# EAGLE design EnvironmentMonitorV6.0 (EAGLE 7.4.0)
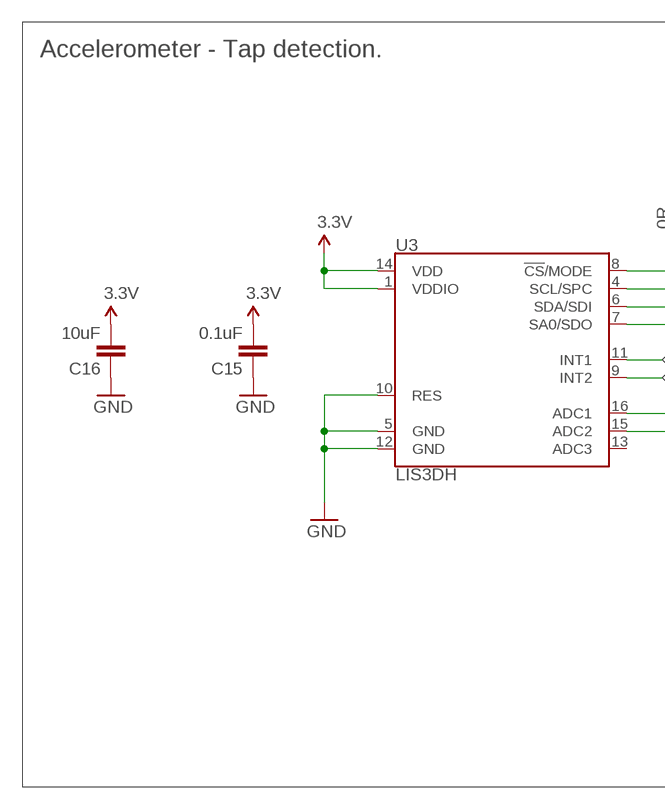
[diagram p0: schematic, sheet 1, part 1 of 2]
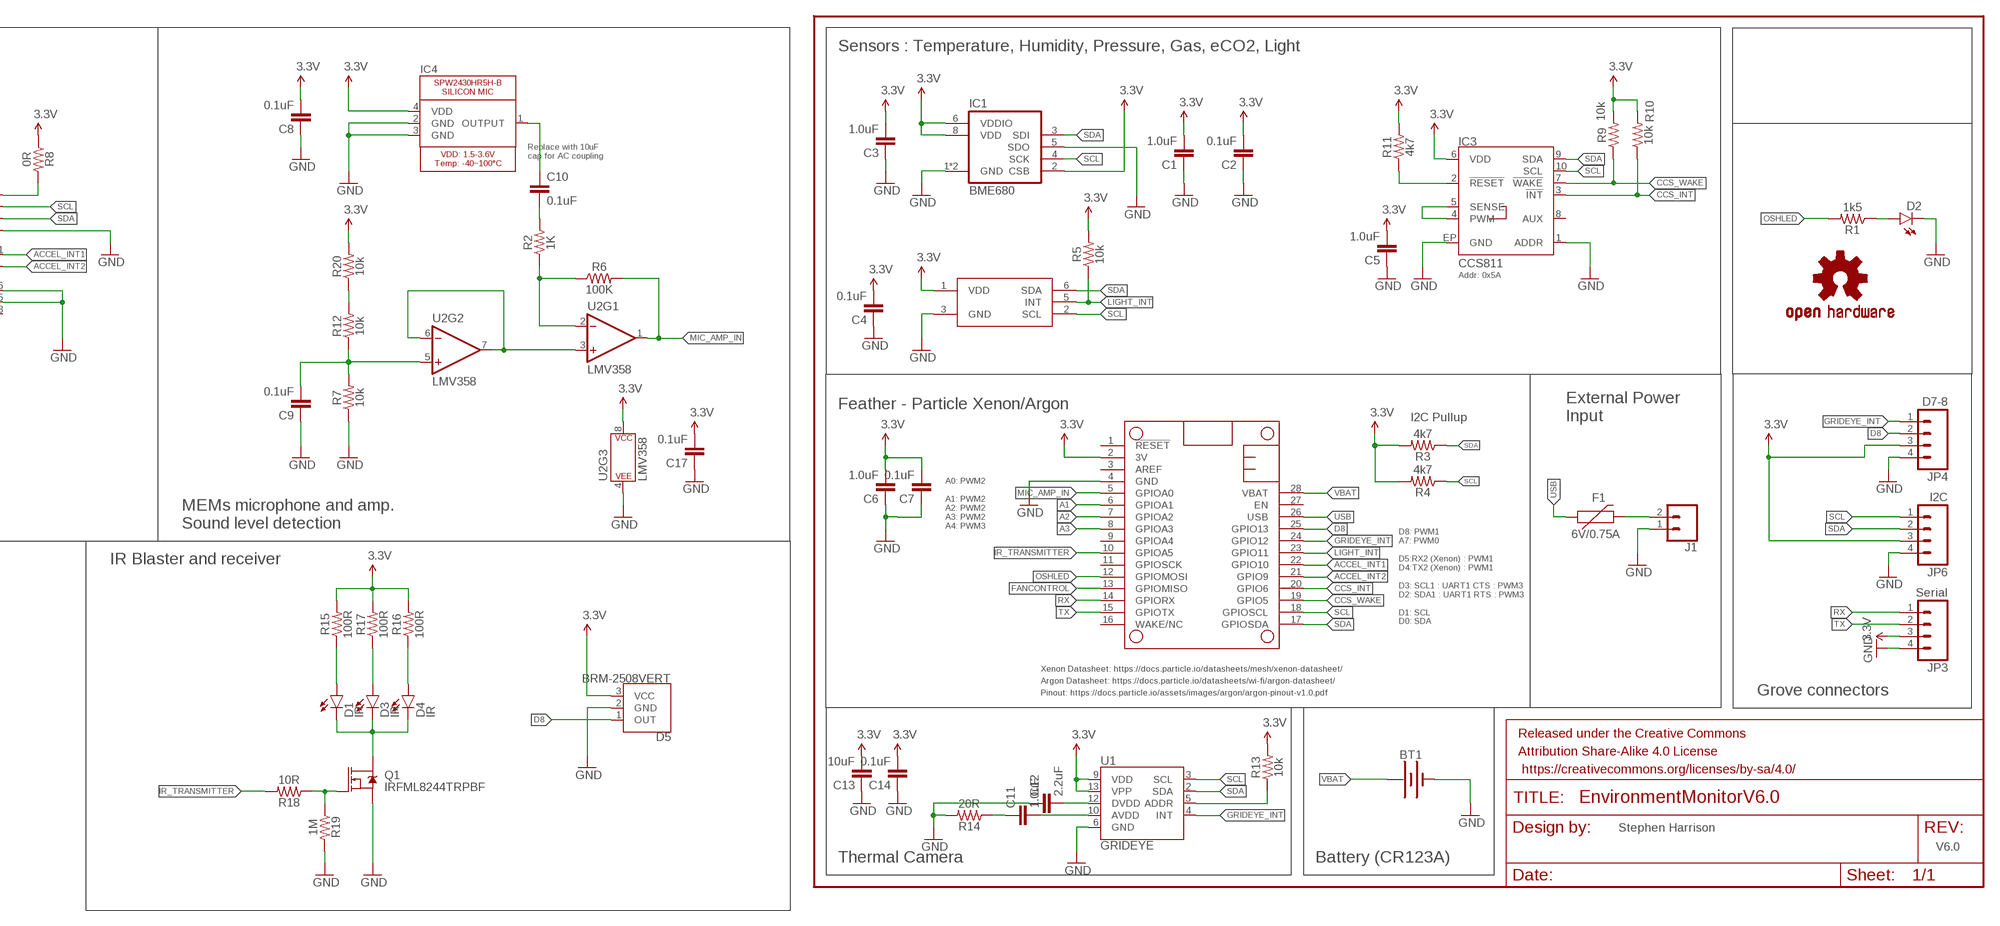
[diagram p1: schematic, sheet 1, part 2 of 2]

## Parts
BT1  BATTERY-16340  [BATTERY_16340-HOLDER]
C1  1.0uF  1.0UF-25V-+80/-20(0805)"  [0805-CAP]
C2  0.1uF  1.0UF-25V-+80/-20(0805)"  [0805-CAP]
C3  1.0uF  1.0UF-25V-+80/-20(0805)"  [0805-CAP]
C4  0.1uF  1.0UF-25V-+80/-20(0805)"  [0805-CAP]
C5  1.0uF  1.0UF-25V-+80/-20(0805)"  [0805-CAP]
C6  1.0uF  1.0UF-25V-+80/-20(0805)"  [0805-CAP]
C7  0.1uF  1.0UF-25V-+80/-20(0805)"  [0805-CAP]
C8  0.1uF  1.0UF-25V-+80/-20(0805)"  [0805-CAP]
C9  0.1uF  1.0UF-25V-+80/-20(0805)"  [0805-CAP]
C10  0.1uF  1.0UF-25V-+80/-20(0805)"  [0805-CAP]
C11  1.0uF  1.0UF-25V-+80/-20(0805)"  [0805-CAP]
C12  2.2uF  1.0UF-25V-+80/-20(0805)"  [0805-CAP]
C13  10uF  1.0UF-25V-+80/-20(0805)"  [0805-CAP]
C14  0.1uF  1.0UF-25V-+80/-20(0805)"  [0805-CAP]
C15  0.1uF  1.0UF-25V-+80/-20(0805)"  [0805-CAP]
C16  10uF  1.0UF-25V-+80/-20(0805)"  [0805-CAP]
C17  0.1uF  1.0UF-25V-+80/-20(0805)"  [0805-CAP]
D1  IR  LED1206  [LED-1206]
D2  LED1206-BOTTOM  [LED-1206-BOTTOM]
D3  IR  LED1206  [LED-1206]
D4  IR  LED1206  [LED-1206]
D5  BRM-2508VERT  [BRM-2508_VERT]
F1  6V/0.75A  PPTC_THREE-QUARTER-AMP  [1206]
FRAME1  FRAME-LETTER  [CREATIVE_COMMONS]
IC1  BME680  [BME680]
IC2  TCS3472  [FN-6]
IC3  CCS811  [LGA10]
IC4  SPW2430HR5H-B  [SPW2430HR5H-B]
IC5  FEATHERWING_NODIM  [FEATHERWING_DIM]
J1  CONN_02-JST-2MM-SMT  [JST-2-SMD]
JP3  Serial  M04JST-PTH-VERT  [JST-4-PTH-VERT]
JP4  D7-8  M04JST-PTH-VERT  [JST-4-PTH-VERT]
JP6  I2C  M04JST-PTH-VERT  [JST-4-PTH-VERT]
LOGO1  OSHW-LOGOM  [OSHW-LOGO-M]
Q1  IRFML8244TRPBF  MOSFET-NCH-BSS138  [SOT23-3]
R1  1k5  RESISTOR0805  [0805]
R2  1K  RESISTOR0805  [0805]
R3  4k7  RESISTOR0805  [0805]
R4  4k7  RESISTOR0805  [0805]
R5  10k  RESISTOR0805  [0805]
R6  100K  RESISTOR0805  [0805]
R7  10k  RESISTOR0805  [0805]
R8  0R  RESISTOR0805  [0805]
R9  10k  RESISTOR0805  [0805]
R10  10k  RESISTOR0805  [0805]
R11  4k7  RESISTOR0805  [0805]
R12  10k  RESISTOR0805  [0805]
R13  10k  RESISTOR0805  [0805]
R14  20R  RESISTOR0805  [0805]
R15  100R  RESISTOR0805  [0805]
R16  100R  RESISTOR0805  [0805]
R17  100R  RESISTOR0805  [0805]
R18  10R  RESISTOR0805  [0805]
R19  1M  RESISTOR0805  [0805]
R20  10k  RESISTOR0805  [0805]
U1  GRIDEYE  [GRIDEYE-AMG88]
U2  LMV358  LMV358SOIC  [SO08]
U3  LIS3DH  [LGA-16-3X3]

## Nets
3.3V: C1.2 C2.2 C3.2 C4.2 C5.2 C6.2 C7.2 C8.2 C13.2 C14.2 C15.2 C16.2 C17.2 D5.3(VCC) IC1.2(CSB) IC1.6(VDDIO) IC1.8(VDD) IC2.1(VDD) IC3.6(VDD) IC4.4(VDD) IC5.2(3V) JP3.3 JP4.3 JP6.3 R3.2 R4.2 R5.2 R8.1 R9.2 R10.2 R11.2 R13.2 R15.2 R16.2 R17.2 R20.2 U1.9(VDD) U1.13(VPP) U2.8(P$V+) U3.1(VDDIO) U3.14(VDD)
A1: IC5.6(GPIOA1)
A2: IC5.7(GPIOA2)
A3: IC5.8(GPIOA3)
ACCEL_INT1: IC5.22(GPIO10) U3.11(INT1)
ACCEL_INT2: IC5.21(GPIO9) U3.9(INT2)
CCS8_RESET: IC3.2(!RESET!) R11.1
CCS_INT: IC3.3(!INT!) IC5.20(GPIO6) R10.1
CCS_WAKE: IC3.7(!WAKE!) IC5.19(GPIO5) R9.1
D8: D5.1(OUT) IC5.25(GPIO13) JP4.2
FANCONTROL: IC5.13(GPIOMISO)
GND: BT1.P$2(-) C1.1 C2.1 C3.1 C4.1 C5.1 C6.1 C7.1 C8.1 C9.1 C12.1 C13.1 C14.1 C15.1 C16.1 C17.1 D2.C D5.2(GND) IC1.1(GND) IC1.5(SDO) IC1.7(GND) IC2.3(GND) IC3.1(ADDR) IC3.EP(GND) IC4.2(GND) IC4.3(GND) IC5.4(GND) J1.1 JP3.4 JP4.4 JP6.4 Q1.2(S) R7.1 R14.2 R19.2 U1.6(GND) U2.4(P$V-) U3.5(GND) U3.7(SA0/SDO) U3.10(RES) U3.12(GND) U3.15(ADC2) U3.16(ADC1)
GRIDEYE_INT: IC5.24(GPIO12) JP4.1 U1.4(INT)
IR_TRANSMITTER: IC5.10(GPIOA5) R18.2
LIGHT_INT: IC2.5(INT) IC5.23(GPIO11) R5.1
MIC_AMP_IN: IC5.5(GPIOA0) R6.2 U2.1(OUT)
N$1: R2.1 R6.1 U2.2(-IN)
N$2: D1.A R15.1
N$3: IC3.4(PWM) IC3.5(SENSE)
N$4: C10.2 R2.2
N$5: U2.3(+IN) U2.6(-IN) U2.7(OUT)
N$6: D2.A R1.1
N$7: C10.1 IC4.1(OUTPUT)
N$8: D3.A R17.1
N$9: C9.2 R7.2 R12.1 U2.5(+IN)
N$10: R13.1 U1.5(ADDR)
N$11: D1.C D3.C D4.C Q1.3(D)
N$12: R12.2 R20.1
N$13: D4.A R16.1
N$14: C12.2 U1.12(DVDD)
N$15: C11.2 U1.10(AVDD)
N$16: C11.1 R14.1
N$18: Q1.1(G) R18.1 R19.1
N$19: F1.2 J1.2
N$25: R8.2 U3.8(!CS!/MODE)
OSHLED: IC5.12(GPIOMOSI) R1.2
RX: IC5.14(GPIORX) JP3.1
SCL: IC1.4(SCK) IC2.2(SCL) IC3.10(SCL) IC5.18(GPIOSCL) JP6.1 R4.1 U1.3(SCL) U3.4(SCL/SPC)
SDA: IC1.3(SDI) IC2.6(SDA) IC3.9(SDA) IC5.17(GPIOSDA) JP6.2 R3.1 U1.2(SDA) U3.6(SDA/SDI)
TX: IC5.15(GPIOTX) JP3.2
USB: F1.1 IC5.26(USB)
VBAT: BT1.P$1(+) IC5.28(VBAT)
Unconnected: IC3.8(AUX) IC5.1(!RESET) IC5.3(AREF) IC5.9(GPIOA4) IC5.11(GPIOSCK) IC5.16(WAKE/NC) IC5.27(EN) U3.13(ADC3)

## Notes on the sheet
- Accelerometer - Tap detection. | Sensors : Temperature, Humidity, Pressure, Gas, eCO2, Light
- Replace with 10uF 
  cap for AC coupling
- Addr: 0x5A
- Feather - Particle Xenon/Argon
- I2C Pullup
- External Power 
  Input
- MEMs microphone and amp.
  Sound level detection
- A0: PWM2
  
  A1: PWM2
  A2: PWM2
  A3: PWM2
  A4: PWM3
- IR Blaster and receiver
- D8: PWM1
  A7: PWM0
  
  D5:RX2 (Xenon) : PWM1
  D4:TX2 (Xenon) : PWM1
  
  D3: SCL1 : UART1 CTS : PWM3
  D2: SDA1 : UART1 RTS : PWM3
  
  D1: SCL
  D0: SDA
- Xenon Datasheet: https://docs.particle.io/datasheets/mesh/xenon-datasheet/
- Argon Datasheet: https://docs.particle.io/datasheets/wi-fi/argon-datasheet/
- Pinout: https://docs.particle.io/assets/images/argon/argon-pinout-v1.0.pdf | Grove connectors
- Stephen Harrison
- V6.0
- Thermal Camera | Battery (CR123A)

## Library data of the parts
BT1 = ThingySticks:BATTERY: Battery - Single Cell A variety of battery chemistries, sizes, and footprints. Device List: 20MM_PTH - Coin Cell Battery Holder - 20mm (PTH) <https://www.sparkfun.com/products/783> 12MM_SMD - Coin Cell Battery Holder - 12mm (SMD) <https://www.sparkfun.com/products/10592> 12MM_PTH - Coin Cell Battery Holder - 12mm (PTH) <https://www.sparkfun.com/products/7948> 20MM_SMD - 20mm Coin Cell Battery Holder (SMD) (2 legs) Used on the Big Time Watch Kit <https://www.sparkfun.com/products/11734> 20MM_SMD_4LEGS - Coin Cell Battery Holder - 20mm (SMD) <https://www.sparkfun.com/products/11892> 20MM_SMD_4LEGS_OVERPASTE - Coin Cell Battery Holder - 20mm (SMD) <https://www.sparkfun.com/products/11892> (Over-paste on the legs) 24.5MM_PTH - Coin Cell Battery Holder - 24.5mm (PTH) <https://www.sparkfun.com/products/8863> 9V - 9V Battery Holder - PC Mount Used on the SparkFun SparkPunk Sound Kit <https://www.sparkfun.com/products/11177> and SparkFun SparkPunk Sequencer Kit <https://www.sparkfun.com/products/12707> 18650 - Battery Holder - 18650 (PTH) <https://www.sparkfun.com/products/13113> AA - Battery Holder - 1xAA (PTH) <https://www.sparkfun.com/products/7949> AAA - Battery Holder - 1xAAA (PTH) <https://www.sparkfun.com/products/12718> AA_KIT - Battery Holder - 1xAA (PTH) <https://www.sparkfun.com/products/7949> Special kit package - pads only have exposed copper on one side of the board. AAA_KIT - Battery Holder - 1xAAA (PTH) <https://www.sparkfun.com/products/12718> Special kit package - pads only have exposed copper on one side of the board.
C1 C3 C5 C6 C11 = SparkFun-Capacitors:1.0UF-25V-+80/-20(0805): CAP-11625; PROD_ID: CAP-11625
C2 C4 C7-C10 C13-C17 = SparkFun-Capacitors:1.0UF-25V-+80/-20(0805): CAP-11625; PROD_ID: CAP-11625; VALUE: 1.0uF
C12 = SparkFun-Capacitors:1.0UF-25V-+80/-20(0805): CAP-11625; FARNELL: 2070473; PROD_ID: CAP-11625; VALUE: 1.0uF
D1 D3 D4 = SparkFun-LED:LED: LEDs Standard schematic elements and footprints for 5mm, 3mm, 1206, and 0603 sized LEDs. 5mm - Spark Fun Electronics SKU : COM-00529 (and others); FARNELL: 2313501
D2 = SparkFun-LED:LED: LEDs Standard schematic elements and footprints for 5mm, 3mm, 1206, and 0603 sized LEDs. 5mm - Spark Fun Electronics SKU : COM-00529 (and others)
D5 = SparkFun-Sensors:BRM-2508: BRM-2508 IR Receiver Module 2.7V/5.5V IR Receiver with Low Power Consumption, High-immunity Against Ambient Light. Example Datasheet <http://www.sinoskysun.com/upload/20110512/201105120447164615.PDF>; PROD_ID: COMP-12059
F1 = SparkFun-Fuses:PPTC: Resettable Fuse PPTC Resettable Fuse. Really a sort of resistor with a polymeric positive temperature coefficient whose resistance increases dramatically with an increase in temperature. When heated by the power passing through the resistance rises causing the current to be limited, protecting the circuit. This is achieved by the transition of the polymer from a crystalline to an amorphous state where the conductive carbon separates breaking the conductive pathways found in the cool crystalline structure. When a PPTC cools back down it resumes conducting letting the circuit turn back on. SparkFun Products: SparkFun RedBoard - Programmed with Arduino <https://www.sparkfun.com/products/12757> Pro Micro - 5V/16MHz <https://www.sparkfun.com/products/12640> Arduino Pro 328 - 5V/16MHz <https://www.sparkfun.com/products/10915> MP3 Trigger <https://www.sparkfun.com/products/13720>; FARNELL: 2786571; PROD_ID: RES-11150
FRAME1 = SparkFun-Aesthetics:FRAME-LETTER: Schematic Frame Standard 8.5x11 US Letter frame
IC1 = ThingySticks:BME680: BME680 integrates for the first time individual high linearity and high accuracy sensors for gas, pressure, humidity and temperature. The library has been designed by Richard Magdycz <https://www.facebook.com/groups/eaglecadsoftUK> Original version had pins in incorrect places (BME680 uses untypical clockwise direction). Updated 17 Feb 2018 S.Harrison ThingySticks.com
IC2 = TCS3472:TCS3472
IC3 = ThingySticks:CCS811: AMS CCS811 – I2C Digital Gas Sensor Ultra-Low Power Digital Gas Sensor for Monitoring Indoor Air Quality AMS Product Page <http://ams.com/eng/Products/Environmental-Sensors/Gas-Sensors/CCS811> SparkFun Products:; PROD_ID: IC-13607
IC4 = microbuilder:SPW2430HR5H-B: SPW2430HR5H-B - Silicon Microphone
IC5 = ThingySticks:FEATHERWING
J1 = SparkFun-Connectors:CONN_02: Multi connection point. Often used as Generic Header-pin footprint for 0.1 inch spaced/style header connections On any of the 0.1 inch spaced packages, you can populate with these: Break Away Headers - Straight <https://www.sparkfun.com/products/116> (PRT-00116) Break Away Male Headers - Right Angle <https://www.sparkfun.com/products/553> (PRT-00553) Female Headers <https://www.sparkfun.com/products/115> (PRT-00115) Break Away Headers - Machine Pin <https://www.sparkfun.com/products/117> (PRT-00117) Break Away Female Headers - Swiss Machine Pin <https://www.sparkfun.com/products/743> (PRT-00743) For SCREWTERMINALS and SPRING TERMINALS visit here: Screw Terimnals on SparkFun.com <https://www.sparkfun.com/search/results?term=Screw+Terminals> (5mm/3.5mm/2.54mm spacing) This device is also useful as a general connection point to wire up your design to another part of your project. Our various solder wires solder well into these plated through hole pads. Hook-Up Wire - Assortment (Stranded, 22 AWG) <https://www.sparkfun.com/products/11375> (PRT-11375) Hook-Up Wire - Assortment (Solid Core, 22 AWG) <https://www.sparkfun.com/products/11367> (PRT-11367) View the entire wire category on our website here <https://www.sparkfun.com/categories/141> Special notes: Molex polarized connector foot print use with: PRT-08233 with associated crimp pins and housings. 2.54_SCREWTERM for use with PRT-10571. 3.5mm Screw Terminal footprints for PRT-08084 5mm Screw Terminal footprints for use with PRT-08432; PROD_ID: CONN-11443
JP3 JP4 JP6 = SparkFun-Connectors:M04: Header 4 Standard 4-pin 0.1" header. Use with straight break away headers (SKU : PRT-00116), right angle break away headers (PRT-00553), swiss pins (PRT-00743), machine pins (PRT-00117), and female headers (PRT-00115). Molex polarized connector foot print use with SKU : PRT-08231 with associated crimp pins and housings. 1MM SMD Version SKU: PRT-10208
LOGO1 = SparkFun-Aesthetics:OSHW-LOGO: Open Source Hardware Logo This logo indicates the piece of hardware it is found on incorporates a OSHW license and/or adheres to the definition of open source hardware found here: http://freedomdefined.org/OSHW
Q1 = SparkFun-DiscreteSemi:MOSFET-NCH: N-channel MOSFETs Voltage controlled devices that allow control of high current outputs. SparkFun Products: SparkFun OpenScale <https://www.sparkfun.com/products/13261> SparkFun Digital Sandbox <https://www.sparkfun.com/products/12651> SparkFun Monster Moto Shield <https://www.sparkfun.com/products/10182> SparkFun MOSFET Power Controller <https://www.sparkfun.com/products/11214>; FARNELL: 1857298; PROD_ID: TRANS-00830; VALUE: 220mA/50V/3.5Ω
R1-R13 R15-R18 R20 = SparkFun-Resistors:RESISTOR: Generic Resistor Package
R14 = SparkFun-Resistors:RESISTOR: Generic Resistor Package; FARNELL: 2447604
R19 = SparkFun-Resistors:RESISTOR: Generic Resistor Package; FARNELL: 2129354
U1 = SparkFun-Sensors:GRIDEYE: Panasonic AMG8833 GRIDEye This 8x8 thermopile infrared sensor array allows for a low resolution thermal camera.; PROD_ID: IC-13912
U2 = SparkFun-IC-Amplifiers:LMV358: IC LMV358 DUAL OP AMP Jellybean rail-to-rail output op-amp SparkFun Products SparkFun PicoBoard <https://www.sparkfun.com/products/11888> (WIG-11888) SparkFun Vernier Interface Shield <https://www.sparkfun.com/products/12858> (DEV-12858) SparkFun Blynk Board - ESP8266 <https://www.sparkfun.com/products/13794> (WRL-13794) SparkFun Digital Sandbox <https://www.sparkfun.com/products/12651> (DEV-12651 RoHS); PROD_ID: IC-09657
U3 = SparkFun-Sensors:LIS3DH: ST Microelectronics LIS3DH 3-Axis ±2/4/8/16g SPI/I2C Accelerometer The LIS3DH is a three axis MEMS linear accelerometer in the "nano" family. It has a digital I2C/SPI serial interface which makes it ideal for using in embedded applications. The device also features ultra low-power operational modes that allow advanced power saving and smart sleep to wake-up functions, built in detections with interrupts, and auxiliary ADC inputs Datasheet-XXXX <http://www.sparkfun.com/datasheets/Sensors/Accelerometer/LIS3DH.pdf> SparkFun Products SparkFun Triple Axis Accelerometer Breakout - LIS3DH <https://www.sparkfun.com/products/10345> (SEN-XXXXX) Triple Axis Accelerometer - LIS3DH <https://www.sparkfun.com/products/9755> (SEN-XXXXX); PROD_ID: IC-13419; SF_ID: N/A

## Board
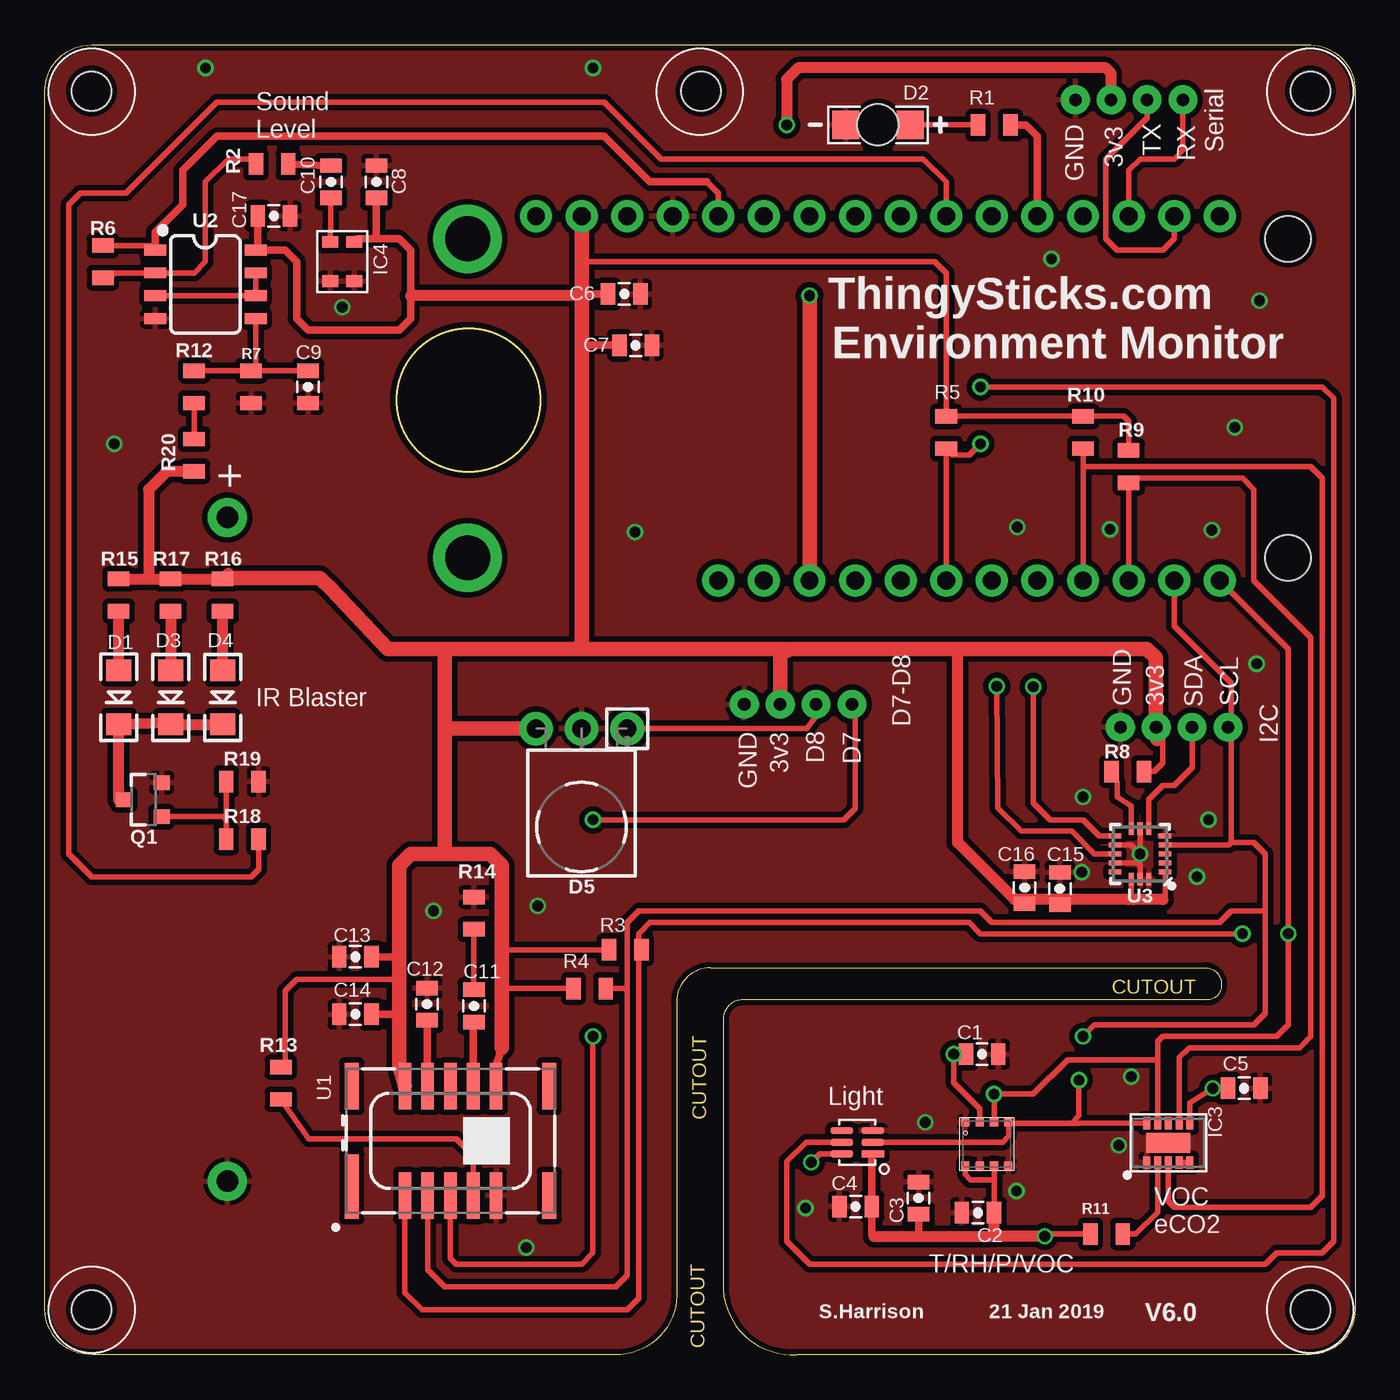
[diagram p2: board, top side]
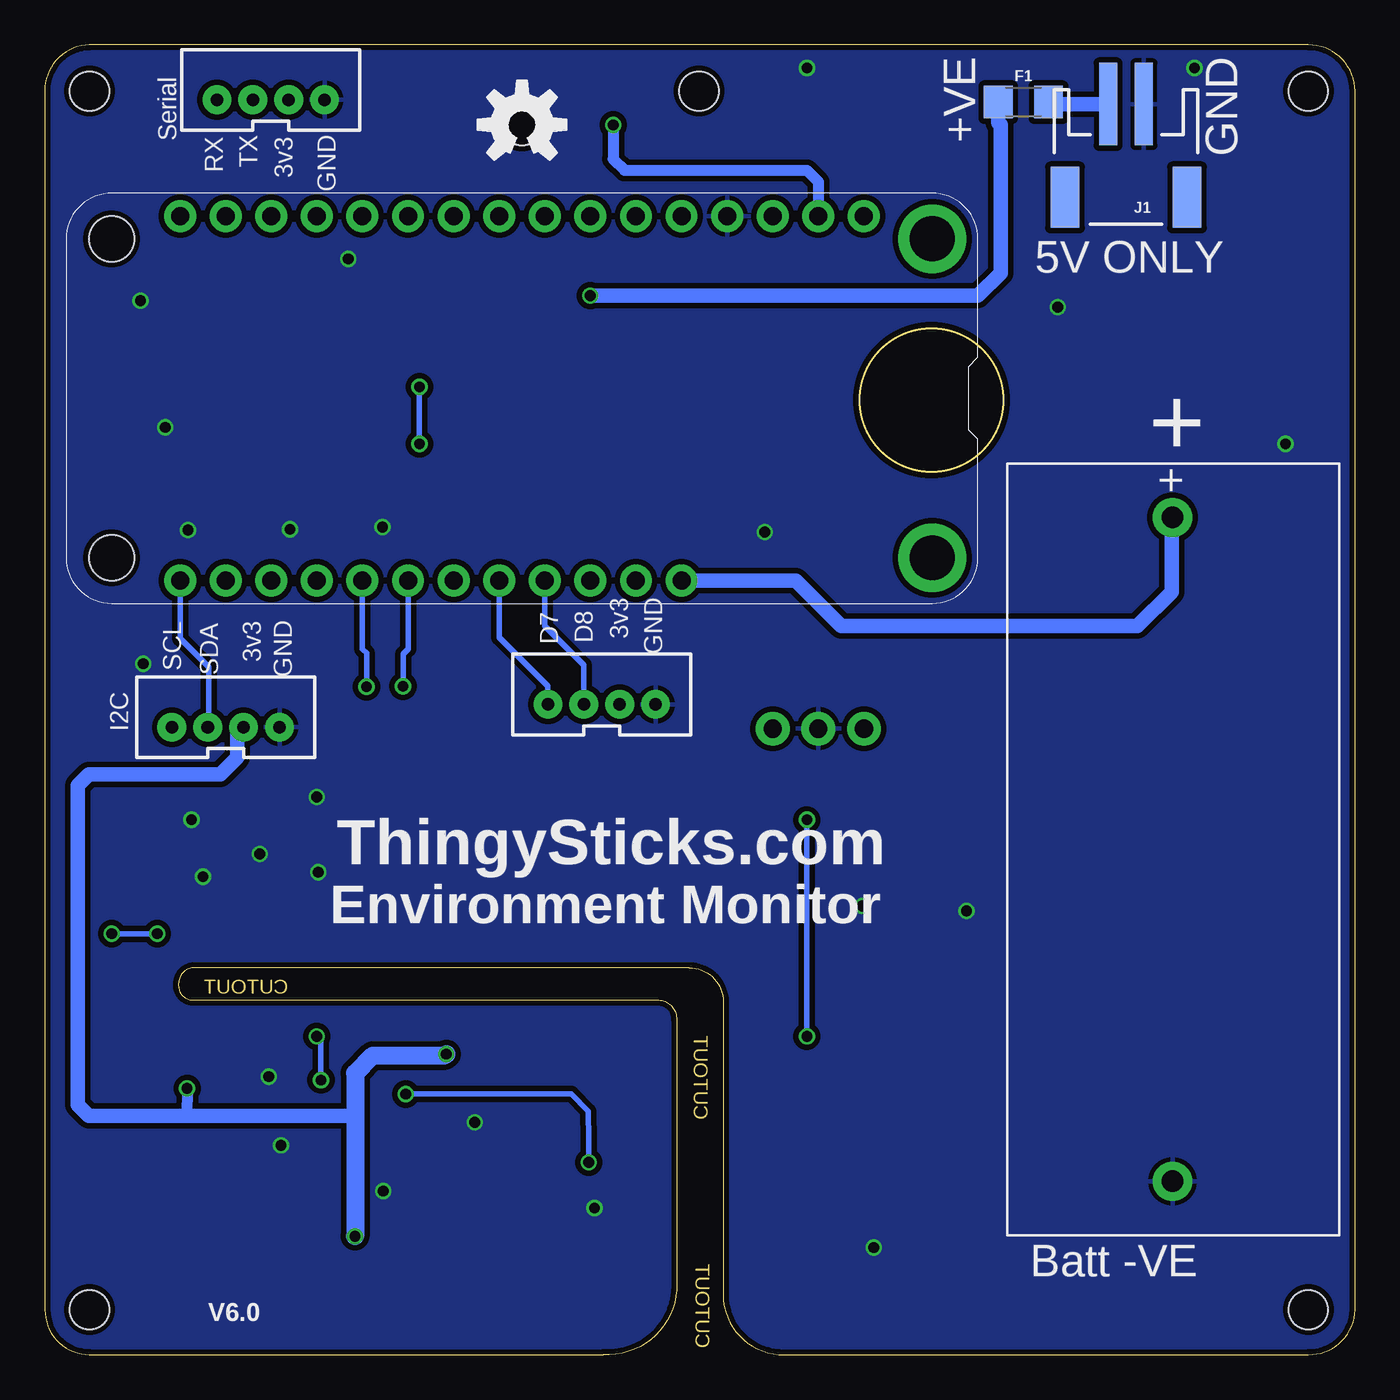
[diagram p3: board, bottom side, seen from below]

Size 73 x 73.01 mm. Coordinates in mm from the lower left corner, seen from the top.
Outline: 0,2.51 0,70.43 arc-90 2.6,73.01 70.52,73.01 arc-90 73,70.43 73,2.51 arc-90 70.52,0.01 41.9,0.01 arc-90 37.8,3.61 37.8,18.67 arc-90 38.8,19.77 64.75,19.77 arc90 65.55,20.57 65.55,20.67 arc90 64.66,21.57 37.1,21.57 arc90 35.2,19.67 35.2,3.61 arc-90 32.1,0.01 2.6,0.01 arc-90 0,2.51
Outline: circle at 23.6,53.21 radius 4
Copper layers (1*16): Top 0.035mm / dielectric 1.5mm / Bottom 0.035mm
Design rules "dirt_cheap_dirty_boards.v1": minimum track width 5mil, minimum drill 12mil, track to track 5mil, track to pad 5mil, pad to pad 5mil, via to via 5mil, smd to smd 0mil, copper to edge 10mil, drill to drill 10mil, minimum pad ring 10mil, minimum via ring 6mil, stop-mask expansion 2mil, vias tented up to drill 25mil, thermal gap 10mil
Holes 2.2 mm at 2.6,2.51 70.52,2.51 70.52,70.43 36.56,70.43 2.6,70.43

### Footprints (pad centres in the part's own frame; a part is rotated, then mirrored left to right if it is on the bottom)
BATTERY_16340-HOLDER = drill 1.2 pad 2.184: P$1 3,9.2; P$2 40,9.2
0805-CAP = smd 0.8 x 1.2: 1 -0.9,0; 2 0.9,0
LED-1206 = smd 1.2 x 1.4: A -1.5,0; C 1.5,0
LED-1206-BOTTOM = smd 1.5 x 1.6: A -1.8,0; C 1.8,0 | hole 2.3: 0,0
BRM-2508_VERT = drill 1.016 pad 1.88: 1 -2.54,0; 2 0,0; 3 2.54,0
1206 = smd 1.6 x 1.8: 1 -1.4,0; 2 1.4,0
BME680 = smd 0.45 x 0.45: 1 1.2,-1.2; 2 0.4,-1.2; 3 -0.4,-1.2; 4 -1.2,-1.2; 5 -1.2,1.2; 6 -0.4,1.2; 7 0.4,1.2; 8 1.2,1.2
FN-6 = smd 1.25 x 0.4: 1 -0.875,0.65; 2 -0.875,0; 3 -0.875,-0.65; 4 0.875,-0.65; 5 0.875,0; 6 0.875,0.65
LGA10 = smd 0.7 x 0.4: 1 -1.1,1.2; 2 -1.1,0.6; 3 -1.1,0; 4 -1.1,-0.6; 5 -1.1,-1.2; 6 1.1,-1.2; 7 1.1,-0.6; 8 1.1,0; 9 1.1,0.6; 10 1.1,1.2 | smd 1.1 x 2.45: EP 0,0
SPW2430HR5H-B = smd 0.9 x 0.66: 1 -0.675,1.095; 2 -0.675,-1.095; 3 0.675,-1.095; 4 0.675,1.095
FEATHERWING_DIM = drill 1 pad 1.778: 1 6.35,1.27; 2 8.89,1.27; 3 11.43,1.27; 4 13.97,1.27; 5 16.51,1.27; 6 19.05,1.27; 7 21.59,1.27; 8 24.13,1.27; 9 26.67,1.27; 10 29.21,1.27; 11 31.75,1.27; 12 34.29,1.27; 13 36.83,1.27; 14 39.37,1.27; 15 41.91,1.27; 16 44.45,1.27; 17 44.45,21.59; 18 41.91,21.59; 19 39.37,21.59; 20 36.83,21.59; 21 34.29,21.59; 22 31.75,21.59; 23 29.21,21.59; 24 26.67,21.59; 25 24.13,21.59; 26 21.59,21.59; 27 19.05,21.59; 28 16.51,21.59 | drill 2.5 pad 3.81: P$1 2.54,20.32; P$2 2.54,2.54 | hole 2.54: 48.26,20.32; 48.26,2.54
JST-2-SMD = smd 1 x 4.6: 1 -1,-3.7; 2 1,-3.7 | smd 1.6 x 3.4: NC1 -3.4,1.5; NC2 3.4,1.5
JST-4-PTH-VERT = drill 0.7 pad 1.6: 1 -3,-0.55; 2 -1,-0.55; 3 1,-0.55; 4 3,-0.55
SOT23-3 = smd 0.8 x 0.9: 1 -0.95,-1; 2 0.95,-1; 3 0,1.1
0805 = smd 0.8 x 1.2: 1 -0.9,0; 2 0.9,0
GRIDEYE-AMG88 = smd 0.8 x 3.6: 1 -5.5,-2.55 | smd 0.7 x 2.6: 2 -2.54,-3.05; 3 -1.27,-3.05; 4 0,-3.05; 5 1.27,-3.05; 6 2.54,-3.05; 9 2.54,3.05; 10 1.27,3.05; 11 0,3.05; 12 -1.27,3.05; 13 -2.54,3.05 | smd 0.8 x 2.6: 7 5.5,-3.05; 8 5.5,3.05; 14 -5.5,3.05
SO08 = smd 0.6 x 1.2: 1 -1.905,-2.8; 2 -0.635,-2.8; 3 0.635,-2.8; 4 1.905,-2.8; 5 1.905,2.8; 6 0.635,2.8; 7 -0.635,2.8; 8 -1.905,2.8
LGA-16-3X3 = smd 0.7 x 0.28: 1 -1.4,1; 2 -1.4,0.5; 3 -1.4,0; 4 -1.4,-0.5; 5 -1.4,-1; 9 1.4,-1; 10 1.4,-0.5; 11 1.4,0; 12 1.4,0.5; 13 1.4,1 | smd 0.28 x 0.7: 6 -0.5,-1.4; 7 0,-1.4; 8 0.5,-1.4; 14 0.5,1.4; 15 0,1.4; 16 -0.5,1.4

### Placement (x,y rotation side)
BT1  19.37,49.66 270 bottom
C1  52.22,16.75 180 top
C2  51.99,7.91 0 top
C3  48.68,8.73 270 top
C4  45.18,8.26 0 top
C5  66.83,14.84 180 top
C6  32.28,59.12 180 top
C7  32.92,56.27 180 top
C8  18.48,65.37 270 top
C9  14.66,53.94 90 top
C10  15.94,65.37 90 top
C11  23.9,19.44 270 top
C12  21.3,19.54 270 top
C13  17.3,22.17 0 top
C14  17.3,18.97 0 top
C15  56.55,25.98 270 top
C16  54.6,26.03 270 top
C17  12.76,63.47 180 top
D1  4.12,36.64 270 top
D2  46.41,68.55 180 top
D3  7.01,36.64 270 top
D4  9.9,36.64 270 top
D5  29.91,34.89 180 top
F1  18.48,69.82 0 bottom
FRAME1  0.06,-20.99 0 top  (outside the outline)
IC1  52.48,11.74 180 top
IC2  45.27,11.84 180 top
IC3  62.6,11.81 90 top
IC4  16.57,60.93 0 top
IC5  21.02,64.74 180 bottom
J1  12.76,66.01 180 bottom
JP3  60.41,70.5 0 bottom
JP4  41.97,36.8 0 bottom
JP6  62.93,35.53 0 bottom
LOGO1  46.41,68.55 0 bottom
Q1  5.5,30.94 90 top
R1  52.9,68.54 0 top
R2  12.66,66.36 0 top
R3  32.34,22.57 180 top
R4  30.36,20.41 180 top
R5  50.23,51.4 90 top
R6  3.24,60.93 90 top
R7  11.49,53.94 90 top
R8  60.33,32.5 180 top
R9  60.38,49.5 90 top
R10  57.84,51.4 90 top
R11  59.16,6.73 180 top
R12  8.31,53.94 270 top
R13  13.15,15.13 90 top
R14  23.9,24.61 90 top
R15  4.11,42.34 90 top
R16  9.9,42.34 90 top
R17  7.01,42.34 90 top
R18  11,28.74 0 top
R19  11,31.94 0 top
R20  8.31,50.13 270 top
U1  22.6,11.92 0 top
U2  8.95,59.66 270 top
U3  61.02,27.91 180 top

### Tracks (layer width: path | path; a pad name or v marks a point on that pad's centre or on a via)
3.3V  (via drill 0.6)
  Top 0.305: 52.03,12.99 IC1.2 52.09,13.71 50.63,15.16 50.63,16.7 C1.2 | C2.2 52.89,9.75 | 52.89,9.75 IC1.6 | IC1.8 51.29,10.04 51.58,9.75 52.89,9.75 | IC3.6 63.8,14.04 v65.08,14.84 C5.2 | 19.75,20.92 14.03,20.92 13.39,20.29 13.39,16.42 R13.2 | U3.14 60.52,25.5 | 60.52,25.5 60.38,25.37 60.66,25.37 60.52,25.5 | U3.1 62.42,25.5 62.29,25.37 | R8.1 61.81,32.5 62.29,32.99 62.29,34.61 JP6.3 | C15.2 57.75,25.33 56.58,25.37 | C16.2 54.71,25.33 54.67,25.37 | 29.91,60.93 49.59,60.93 50.23,60.29 R5.2 R10.2 60.12,52.3 60.38,52.04 R9.2 | 55.9,6.57 v55.72,6.6 55.84,6.73 R11.2 | R3.2 25.72,22.57 25.46,22.83 | R4.2 25.34,20.41 25.46,20.92
  Top 0.406: IC2.1 46.08,11.13 C4.2 46.08,6.7 46.19,6.59 | C3.2 48.68,6.64 49.37,6.59 | C1.2 v50.63,16.75 | C14.2 19.7,18.97 19.75,19.65 | C13.2 19.73,22.17 19.75,22.83 | U1.9 25.14,16.16 25.46,17.11 | 18.48,62.2 19.75,62.2 20.38,61.56 20.38,59.02 20.38,57.75 19.75,57.12 14.66,57.12 14.03,57.75 14.03,60.93 13.39,61.56 U2.8 11.86,61.67 C17.2 | 18.48,62.2 17.42,62.2 IC4.4 | C8.2 18.48,62.2 | C7.2 30.12,56.27 29.91,56.48 | C6.2 30.01,59.12 29.91,59.02
  Top 0.61: 46.19,6.59 49.37,6.59 52.86,6.59 | v55.72,6.6 55.72,6.59 52.86,6.59 | C2.2 52.86,7.91 52.86,6.59 | R15.2 5.78,43.24 | 5.78,43.24 R17.2 R16.2 10.22,43.55 | 29.91,59.02 20.38,59.02 | 60.38,25.37 56.58,25.37 54.67,25.37 54.04,25.37 50.86,28.54 50.86,39.34 | 62.29,25.37 60.66,25.37 | R20.2 6.78,49.23 5.78,48.23 5.78,43.24 | JP3.3 59.41,71.42 59.12,71.72 41.97,71.72 41.34,71.09 v41.34,68.55
  Top 0.813: IC5.2 29.91,60.93 29.91,59.02 29.91,56.48 29.91,39.34 | 22.29,39.34 19.11,39.34 15.94,42.69 15.32,43.3 9.97,43.3 R16.2 | 22.29,39.34 22.29,34.89 | 22.29,34.89 22.29,27.91 | 22.29,27.91 24.83,27.91 25.46,27.27 25.46,22.83 25.46,20.92 25.46,17.11 | 61.98,34.31 JP6.3 61.88,35.02 61.88,38.85 61.4,39.34 50.86,39.34 41.61,39.34 40.97,39.07 | D5.3 22.29,34.89 | 22.29,27.91 20.38,27.91 19.75,27.27 19.75,22.83 19.75,20.92 19.75,19.65 19.75,16.07 U1.13 | JP4.3 40.97,39.07 | 40.97,39.07 41.34,39.34 29.91,39.34 | 29.91,39.34 22.29,39.34
  Bottom 0.61: v65.08,14.84 65.08,14.82 65.08,13.3 | 55.94,13.3 55.72,13.3 | IC5.2 29.91,65.37 30.54,66.01 40.7,66.01 41.34,66.64 v41.34,68.55
  Bottom 0.813: 55.72,13.53 55.94,13.3 65.08,13.3 70.54,13.3 71.18,13.94 71.18,31.72 70.54,32.35 63.23,32.35 62.29,33.29 62.29,34.61 JP6.3
  Bottom 1.016: v50.63,16.75 50.76,16.68 54.72,16.68 55.72,15.69 55.72,13.53 55.72,13.3 v55.72,6.6
ACCEL_INT1  (via drill 0.6)
  Top 0.305: U3.11 58.48,27.91 57.21,29.18 54.39,29.18 53.09,30.47 v53.04,37.25
  Bottom 0.305: v53.04,37.25 53.04,39.06 52.77,39.34 IC5.22
ACCEL_INT2  (via drill 0.6)
  Top 0.305: U3.9 58.75,28.91 57.84,29.81 56.02,29.81 55.08,30.75 v55.08,37.23
  Bottom 0.305: v55.08,37.23 55.08,39.11 55.3,39.34 IC5.21
CCS8_RESET
  Top 0.305: R11.1 60.8,6.73 62,7.93 IC3.2
CCS_INT
  Top 0.305: IC3.3 62.6,8.55 62.93,8.22 70.54,8.22 71.18,8.86 71.18,48.86 70.54,49.5 57.84,49.5 | R10.1 57.84,49.5 | 57.84,49.5 IC5.20
CCS_WAKE
  Top 0.305: IC3.7 63.2,16.56 63.76,17.11 69.91,17.11 70.54,17.75 70.54,39.97 67.37,43.15 67.37,48.23 66.73,48.86 60.65,48.86 R9.1 IC5.19
D8
  Top 0.305: D5.1 42.45,34.89 42.94,35.53 42.94,35.98 JP4.2
  Bottom 0.305: JP4.2 42.97,38.43 45.15,40.61 IC5.25
GND  (via drill 0.6)
  Top 0.305: U3.15 61.02,27.27 60.88,27.41 U3.12 | U3.10 60.52,28.41 v61.02,27.91 U3.7
  other vias: 42.38,8.18 59.35,46 54.18,46.13 49.05,12.95 65.02,45.97 54.14,9.12 60.53,15.49 32.89,45.85 59.84,11.67 64.83,29.81 21.65,24.73 57.84,31.08 64.19,26.64 30.54,71.72 3.87,50.77 16.57,58.39 8.95,71.72 67.52,38.51 66.3,51.68 27.46,25.02 26.82,5.97 57.77,26.89 56.09,61.08 67.67,58.74
  pour Bottom (isolate 0.305, rank 6): 72.81,72.99 72.91,-0.23 -0.13,0.17 0.06,72.89
  pour Top (isolate 0.305, rank 6): 0.06,72.89 72.81,72.96 72.91,-0.16 -0.13,0.17
GRIDEYE_INT  (via drill 0.6)
  Top 0.305: v30.54,29.81 44.51,29.81 45.15,30.45 45.15,36.07 JP4.1 | U1.4 22.6,5.37 22.92,5.05 29.91,5.05 30.54,5.68 v30.54,17.75
  Bottom 0.305: JP4.1 44.97,37.26 47.69,39.97 IC5.24 | v30.54,17.75 v30.54,29.81
IR_TRANSMITTER
  Top 0.305: R18.2 11.9,27.05 11.49,26.64 2.6,26.64 1.33,27.91 1.33,64.1 1.97,64.74 4.5,64.74 9.59,69.82 31.18,69.82 34.35,66.64 48.95,66.64 50.23,65.37 IC5.10
LIGHT_INT  (via drill 0.6)
  Top 0.305: IC2.5 42.41,11.84 41.34,10.76 41.34,6.32 42.61,5.05 68,5.05 68.64,5.68 71.18,5.68 71.81,6.32 71.81,53.31 71.18,53.94 v52.13,53.94 | IC5.23 R5.1 50.59,50.13 51.5,50.13 v52.13,50.77
  Bottom 0.305: v52.13,53.94 v52.13,50.77
MIC_AMP_IN
  Top 0.305: R6.2 5.88,61.83 U2.1 | IC5.5 37.52,64.74 36.89,65.37
  Top 0.406: U2.1 6.15,62.57 7.68,64.1 7.68,66.01 9.59,67.91 31.18,67.91 33.71,65.37 36.89,65.37
N$1
  Top 0.305: R2.1 11.5,66.64 10.22,66.64 8.95,65.37 8.95,60.93 8.31,60.29 U2.2 3.87,60.29 3.6,60.03 R6.1
N$2
  Top 0.61: D1.A R15.1
N$3
  Top 0.305: IC3.4 IC3.5
N$4
  Top 0.406: R2.2 C10.2
N$5
  Top 0.305: U2.7 U2.6 U2.3
N$6
  Top 0.305: D2.A 51.98,68.55 R1.1
  Top 0.406: 51.9,68.64 R1.1
N$7
  Top 0.305: C10.1 15.94,63.29 IC4.1
N$8
  Top 0.61: R17.1 D3.A
N$9
  Top 0.305: R12.1 R7.2 | R7.2 C9.2 | U2.5 11.75,55.1 R7.2
N$10
  Top 0.305: U1.5 23.87,11.08 22.92,12.03 14.71,12.03 R13.1
N$11
  Top 0.61: Q1.3 4.11,30.94 D1.C 7.01,35.24 D3.C D4.C
N$12
  Top 0.305: R12.2 R20.1
N$13
  Top 0.61: D4.A R16.1
N$14
  Top 0.406: C12.2 21.3,15.79 U1.12
N$15
  Top 0.406: U1.10 23.87,18.51 C11.2
N$16
  Top 0.305: C11.1 R14.1
N$18
  Top 0.305: R19.1 10.11,29.81 | 10.11,29.81 R18.1 | Q1.1 9.93,29.99 10.11,29.81
N$19
  Bottom 0.813: J1.2 16.96,69.71 F1.2
N$25
  Top 0.305: U3.8 60.52,30.58 59.75,31.08 59.75,31.88 R8.2
OSHLED
  Top 0.406: R1.2 54.68,68.54 55.3,67.91 IC5.12
RX
  Top 0.305: JP3.1 63.41,67.13 62.93,66.64 61.02,66.64 60.38,66.01 IC5.14
SCL  (via drill 0.6)
  Top 0.305: IC3.10 57.62,12.9 57.21,12.9 | 57.21,12.9 53.72,12.9 IC1.4 53.71,12.91 53.71,12.19 53.36,11.84 IC2.2 | U3.4 65.97,28.41 66.1,28.54 | 66.1,28.54 66.1,34.8 JP6.1 | IC5.18 62.93,40.61 66.1,37.43 66.1,35.15 JP6.1 | v57.84,17.75 58.48,18.38 67.37,18.38 68,19.02 68,24.73 | U1.3 21.33,4.73 22.29,3.78 31.81,3.78 32.45,4.41 32.45,20.29 | 32.45,20.29 32.45,24.1 33.08,24.73 52.13,24.73 52.77,24.1 65.47,24.1 66.1,24.73 68,24.73 | 66.01,34.89 JP6.1 | 68,24.73 68,27.91 67.37,28.54 66.1,28.54 | 57.21,12.9 57.62,13.31 v57.62,15.3 v57.62,15.31 | R4.1 32.32,20.41 32.45,20.29
  Bottom 0.305: v57.62,15.31 57.62,17.52 v57.84,17.75
SDA  (via drill 0.6)
  Top 0.305: IC1.3 52.88,14.5 | IC2.6 43.17,11.19 v42.7,10.72 | IC3.9 62.01,15.86 62.01,16.48 | v52.88,14.53 55.08,14.53 56.98,16.43 61.96,16.43 62.01,16.48 | JP6.2 63.93,32.72 62.93,31.72 62.29,31.72 61.52,30.95 U3.6 | IC5.17 69.27,39.34 v69.27,23.46 69.27,18.38 68.64,17.75 62.29,17.75 62.01,17.46 62.01,16.48 | U1.2 20.06,3.46 21.02,2.51 32.45,2.51 33.08,3.14 33.08,22.19 | 33.08,22.19 33.08,23.46 33.71,24.1 51.5,24.1 52.13,23.46 v66.73,23.46 | R3.1 33.24,22.35 33.08,22.19
  Top 0.406: 52.88,14.5 v52.88,14.53
  Bottom 0.305: v42.7,10.72 42.7,11.99 42.73,13.57 43.68,14.52 v52.88,14.53 | IC5.17 65.47,39.92 63.87,38.32 63.87,35.04 JP6.2 | v66.73,23.46 v69.27,23.46
TX
  Top 0.305: JP3.2 61.41,68.94 59.12,66.64 59.12,62.2 59.75,61.56 62.29,61.56 62.93,62.2 IC5.15
USB  (via drill 0.6)
  Top 0.813: v42.61,59.02 IC5.26
  Bottom 0.813: v42.61,59.02 21.02,59.02 19.75,60.29 19.75,68.55 19.88,68.68 F1.1
VBAT
  Bottom 0.813: IC5.28 31.18,43.15 28.64,40.61 12.12,40.61 10.22,42.51 10.22,46.61 BT1.P$1

### Text on the board
Dimension: CUTOUT | CUTOUT | CUTOUT
tNames: GND | 3v3 | TX | RX | Sound / Level | Serial | ThingySticks.com | Environment Monitor | D7-D8 | IR Blaster | GND | 3v3 | SDA | SCL | I2C | GND | 3v3 | D8 | D7 | Light | VOC / eCO2 | T/RH/P/VOC | S.Harrison | 21 Jan 2019 | V6.0
bNames: GND | +VE | GND | 3v3 | TX | RX | Serial | 5V ONLY | + | GND | 3v3 | D8 | D7 | GND | 3v3 | SDA | SCL | I2C | ThingySticks.com | Environment Monitor | Batt -VE | V6.0
tDocu: Xenon On / Reverse | . mark on Anode | Battery On / Reverse